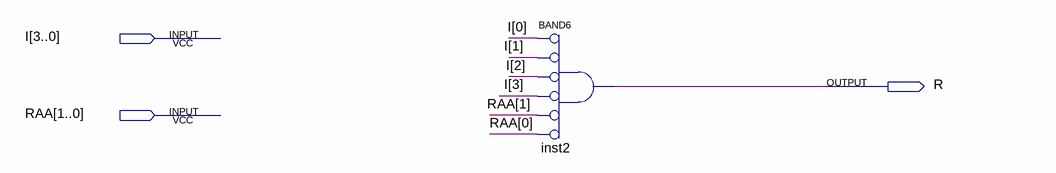
[diagram p0: schematic sheet]
// Quartus schematic Zero.bdf as structural Verilog: 1 symbols, 3 pins
module Zero (
  input  [3:0] I,
  input  [1:0] RAA,
  output R
);

  and inst2 (R, ~I[0], ~I[1], ~I[2], ~I[3], ~RAA[1], ~RAA[0]);  // BAND6
endmodule
